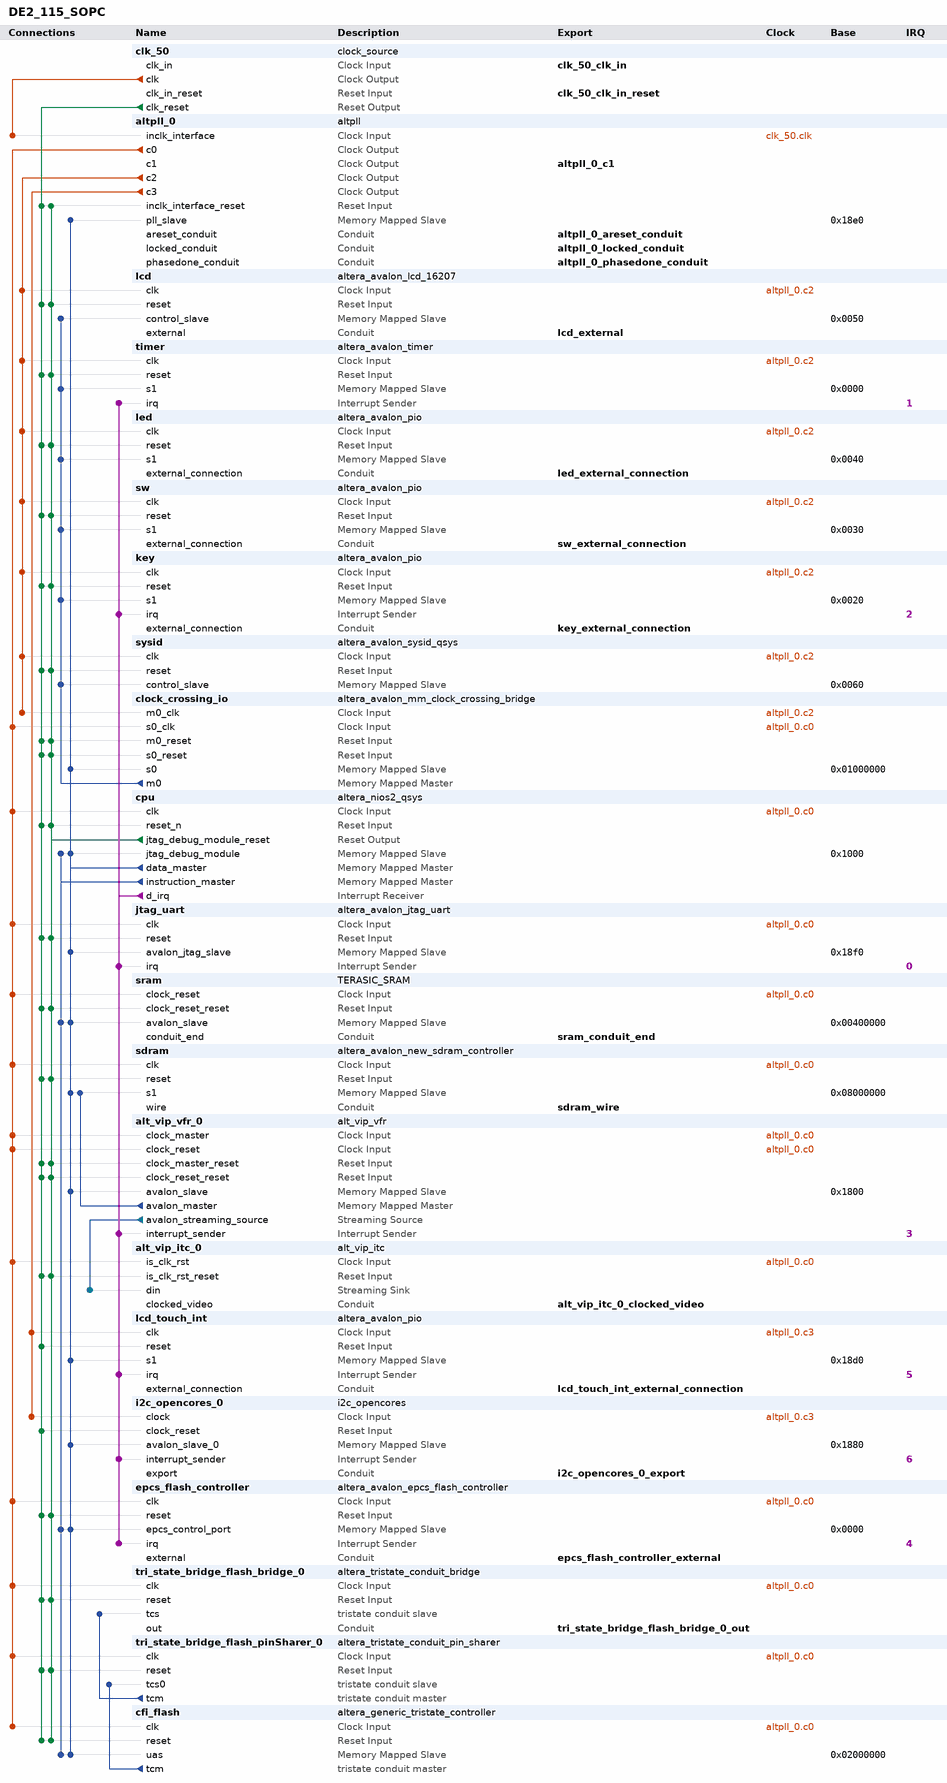
[diagram p0: system contents]
# Platform Designer (Qsys) system DE2_115_SOPC, Cyclone IV E EP4CE115F29C7
# Parameters at their usual value, and those the tool derives, are not listed.
package require -exact qsys 13.1
create_system DE2_115_SOPC
set_project_property DEVICE_FAMILY {Cyclone IV E}
set_project_property DEVICE EP4CE115F29C7

add_instance clk_50 clock_source 13.1
set_instance_parameter_value clk_50 clockFrequency 50000000

add_instance altpll_0 altpll 13.1
set_instance_parameter_value altpll_0 INCLK0_INPUT_FREQUENCY 20000
set_instance_parameter_value altpll_0 CLK0_MULTIPLY_BY 2
set_instance_parameter_value altpll_0 CLK1_MULTIPLY_BY 2
set_instance_parameter_value altpll_0 CLK2_MULTIPLY_BY 2
set_instance_parameter_value altpll_0 CLK3_MULTIPLY_BY 1
set_instance_parameter_value altpll_0 CLK0_DIVIDE_BY 1
set_instance_parameter_value altpll_0 CLK1_DIVIDE_BY 1
set_instance_parameter_value altpll_0 CLK2_DIVIDE_BY 5
set_instance_parameter_value altpll_0 CLK3_DIVIDE_BY 1
set_instance_parameter_value altpll_0 CLK1_PHASE_SHIFT -1667
set_instance_parameter_value altpll_0 CLK2_PHASE_SHIFT 0
set_instance_parameter_value altpll_0 CLK3_PHASE_SHIFT 0
set_instance_parameter_value altpll_0 CLK1_DUTY_CYCLE 50
set_instance_parameter_value altpll_0 CLK2_DUTY_CYCLE 50
set_instance_parameter_value altpll_0 CLK3_DUTY_CYCLE 50
set_instance_parameter_value altpll_0 PORT_clk1 PORT_USED
set_instance_parameter_value altpll_0 PORT_clk2 PORT_USED
set_instance_parameter_value altpll_0 PORT_clk3 PORT_USED
set_instance_parameter_value altpll_0 PORT_ARESET PORT_USED
set_instance_parameter_value altpll_0 PORT_LOCKED PORT_USED

add_instance lcd altera_avalon_lcd_16207 13.1

add_instance timer altera_avalon_timer 13.1
set_instance_parameter_value timer period 1
set_instance_parameter_value timer periodUnits MSEC

add_instance led altera_avalon_pio 13.1
set_instance_parameter_value led direction Output
set_instance_parameter_value led width 27

add_instance sw altera_avalon_pio 13.1
set_instance_parameter_value sw direction Input
set_instance_parameter_value sw width 18

add_instance key altera_avalon_pio 13.1
set_instance_parameter_value key captureEdge true
set_instance_parameter_value key direction Input
set_instance_parameter_value key edgeType FALLING
set_instance_parameter_value key generateIRQ true
set_instance_parameter_value key irqType EDGE
set_instance_parameter_value key width 4

add_instance sysid altera_avalon_sysid_qsys 13.1
set_instance_parameter_value sysid id 0

add_instance clock_crossing_io altera_avalon_mm_clock_crossing_bridge 13.1
set_instance_parameter_value clock_crossing_io DATA_WIDTH 32
set_instance_parameter_value clock_crossing_io ADDRESS_WIDTH 8
set_instance_parameter_value clock_crossing_io MAX_BURST_SIZE 1
set_instance_parameter_value clock_crossing_io COMMAND_FIFO_DEPTH 16
set_instance_parameter_value clock_crossing_io RESPONSE_FIFO_DEPTH 64
set_instance_parameter_value clock_crossing_io MASTER_SYNC_DEPTH 3
set_instance_parameter_value clock_crossing_io SLAVE_SYNC_DEPTH 3

add_instance cpu altera_nios2_qsys 13.1
set_instance_parameter_value cpu manuallyAssignCpuID false
set_instance_parameter_value cpu resetSlave cfi_flash.uas
set_instance_parameter_value cpu exceptionSlave sram.avalon_slave
set_instance_parameter_value cpu breakSlave cpu.jtag_debug_module
set_instance_parameter_value cpu muldiv_multiplierType NoneSmall
set_instance_parameter_value cpu impl Fast
set_instance_parameter_value cpu icache_size 4096

add_instance jtag_uart altera_avalon_jtag_uart 13.1
set_instance_parameter_value jtag_uart simInteractiveOptions INTERACTIVE_ASCII_OUTPUT

add_instance sram TERASIC_SRAM 1.0
set_instance_parameter_value sram DATA_BITS 16
set_instance_parameter_value sram ADDR_BITS 20

add_instance sdram altera_avalon_new_sdram_controller 13.1
set_instance_parameter_value sdram TAC 5.4
set_instance_parameter_value sdram TRCD 20.0
set_instance_parameter_value sdram TRP 20.0
set_instance_parameter_value sdram casLatency 3
set_instance_parameter_value sdram columnWidth 10
set_instance_parameter_value sdram dataWidth 32
set_instance_parameter_value sdram generateSimulationModel false
set_instance_parameter_value sdram model custom
set_instance_parameter_value sdram numberOfBanks 4
set_instance_parameter_value sdram numberOfChipSelects 1
set_instance_parameter_value sdram powerUpDelay 100.0
set_instance_parameter_value sdram refreshPeriod 15.625
set_instance_parameter_value sdram rowWidth 13

add_instance alt_vip_vfr_0 alt_vip_vfr 13.1
set_instance_parameter_value alt_vip_vfr_0 NUMBER_OF_CHANNELS_IN_PARALLEL 3
set_instance_parameter_value alt_vip_vfr_0 MAX_IMAGE_WIDTH 800
set_instance_parameter_value alt_vip_vfr_0 MAX_IMAGE_HEIGHT 480
set_instance_parameter_value alt_vip_vfr_0 MEM_PORT_WIDTH 32
set_instance_parameter_value alt_vip_vfr_0 CLOCKS_ARE_SEPARATE 0

add_instance alt_vip_itc_0 alt_vip_itc 13.1
set_instance_parameter_value alt_vip_itc_0 NUMBER_OF_COLOUR_PLANES 3
set_instance_parameter_value alt_vip_itc_0 H_ACTIVE_PIXELS 800
set_instance_parameter_value alt_vip_itc_0 V_ACTIVE_LINES 480
set_instance_parameter_value alt_vip_itc_0 FIFO_DEPTH 800
set_instance_parameter_value alt_vip_itc_0 THRESHOLD 799
set_instance_parameter_value alt_vip_itc_0 H_SYNC_LENGTH 30
set_instance_parameter_value alt_vip_itc_0 H_FRONT_PORCH 210
set_instance_parameter_value alt_vip_itc_0 H_BACK_PORCH 16
set_instance_parameter_value alt_vip_itc_0 V_SYNC_LENGTH 13
set_instance_parameter_value alt_vip_itc_0 V_FRONT_PORCH 22
set_instance_parameter_value alt_vip_itc_0 V_BACK_PORCH 10

add_instance lcd_touch_int altera_avalon_pio 13.1
set_instance_parameter_value lcd_touch_int captureEdge true
set_instance_parameter_value lcd_touch_int direction Input
set_instance_parameter_value lcd_touch_int edgeType FALLING
set_instance_parameter_value lcd_touch_int generateIRQ true
set_instance_parameter_value lcd_touch_int irqType EDGE
set_instance_parameter_value lcd_touch_int width 1

add_instance i2c_opencores_0 i2c_opencores 12.0

add_instance epcs_flash_controller altera_avalon_epcs_flash_controller 13.1

add_instance tri_state_bridge_flash_bridge_0 altera_tristate_conduit_bridge 13.1

add_instance tri_state_bridge_flash_pinSharer_0 altera_tristate_conduit_pin_sharer 13.1
set_instance_parameter_value tri_state_bridge_flash_pinSharer_0 NUM_INTERFACES 1
set_instance_parameter_value tri_state_bridge_flash_pinSharer_0 MODULE_ORIGIN_LIST cfi_flash.tcm,cfi_flash.tcm,cfi_flash.tcm,cfi_flash.tcm,cfi_flash.tcm
set_instance_parameter_value tri_state_bridge_flash_pinSharer_0 SHARED_SIGNAL_LIST address_to_the_cfi_flash,read_n_to_the_cfi_flash,write_n_to_the_cfi_flash,data_to_and_from_the_cfi_flash,select_n_to_the_cfi_flash

add_instance cfi_flash altera_generic_tristate_controller 13.1
set_instance_parameter_value cfi_flash TCM_ADDRESS_W 23
set_instance_parameter_value cfi_flash TCM_DATA_W 8
set_instance_parameter_value cfi_flash TCM_BYTEENABLE_W 1
set_instance_parameter_value cfi_flash TCM_READ_WAIT 160
set_instance_parameter_value cfi_flash TCM_WRITE_WAIT 160
set_instance_parameter_value cfi_flash TCM_SETUP_WAIT 60
set_instance_parameter_value cfi_flash TCM_DATA_HOLD 60
set_instance_parameter_value cfi_flash TCM_MAX_PENDING_READ_TRANSACTIONS 3
set_instance_parameter_value cfi_flash TCM_TURNAROUND_TIME 2
set_instance_parameter_value cfi_flash TCM_TIMING_UNITS 0
set_instance_parameter_value cfi_flash TCM_READLATENCY 2
set_instance_parameter_value cfi_flash TCM_SYMBOLS_PER_WORD 1
set_instance_parameter_value cfi_flash USE_READ 1
set_instance_parameter_value cfi_flash USE_BEGINTRANSFER 0
set_instance_parameter_value cfi_flash USE_BYTEENABLE 0
set_instance_parameter_value cfi_flash USE_OUTPUTENABLE 0
set_instance_parameter_value cfi_flash ACTIVE_LOW_READ 1
set_instance_parameter_value cfi_flash ACTIVE_LOW_BYTEENABLE 0
set_instance_parameter_value cfi_flash ACTIVE_LOW_OUTPUTENABLE 0
set_instance_parameter_value cfi_flash ACTIVE_LOW_BEGINTRANSFER 0
set_instance_parameter_value cfi_flash CHIPSELECT_THROUGH_READLATENCY 0
set_instance_parameter_value cfi_flash MODULE_ASSIGNMENT_KEYS embeddedsw.configuration.hwClassnameDriverSupportList,embeddedsw.configuration.hwClassnameDriverSupportDefault,embeddedsw.CMacro.SETUP_VALUE,embeddedsw.CMacro.WAIT_VALUE,embeddedsw.CMacro.HOLD_VALUE,embeddedsw.CMacro.TIMING_UNITS,embeddedsw.CMacro.SIZE,embeddedsw.memoryInfo.MEM_INIT_DATA_WIDTH,embeddedsw.memoryInfo.HAS_BYTE_LANE,embeddedsw.memoryInfo.IS_FLASH,embeddedsw.memoryInfo.GENERATE_DAT_SYM,embeddedsw.memoryInfo.GENERATE_FLASH,embeddedsw.memoryInfo.DAT_SYM_INSTALL_DIR,embeddedsw.memoryInfo.FLASH_INSTALL_DIR
set_instance_parameter_value cfi_flash MODULE_ASSIGNMENT_VALUES {altera_avalon_lan91c111:altera_avalon_cfi_flash,altera_avalon_cfi_flash,60,160,60,"ns",8388608u,8,0,1,1,1,SIM_DIR,APP_DIR}
set_instance_parameter_value cfi_flash INTERFACE_ASSIGNMENT_KEYS embeddedsw.configuration.isFlash,embeddedsw.configuration.isMemoryDevice,embeddedsw.configuration.isNonVolatileStorage
set_instance_parameter_value cfi_flash INTERFACE_ASSIGNMENT_VALUES 1,1,1

# connections
add_connection altpll_0.c0 alt_vip_itc_0.is_clk_rst clock
add_connection altpll_0.c0 alt_vip_vfr_0.clock_master clock
add_connection altpll_0.c0 alt_vip_vfr_0.clock_reset clock
add_connection altpll_0.c0 cfi_flash.clk clock
add_connection altpll_0.c0 clock_crossing_io.s0_clk clock
add_connection altpll_0.c0 cpu.clk clock
add_connection altpll_0.c0 epcs_flash_controller.clk clock
add_connection altpll_0.c0 jtag_uart.clk clock
add_connection altpll_0.c0 sdram.clk clock
add_connection altpll_0.c0 sram.clock_reset clock
add_connection altpll_0.c0 tri_state_bridge_flash_bridge_0.clk clock
add_connection altpll_0.c0 tri_state_bridge_flash_pinSharer_0.clk clock
add_connection altpll_0.c2 clock_crossing_io.m0_clk clock
add_connection altpll_0.c2 key.clk clock
add_connection altpll_0.c2 lcd.clk clock
add_connection altpll_0.c2 led.clk clock
add_connection altpll_0.c2 sw.clk clock
add_connection altpll_0.c2 sysid.clk clock
add_connection altpll_0.c2 timer.clk clock
add_connection altpll_0.c3 i2c_opencores_0.clock clock
add_connection altpll_0.c3 lcd_touch_int.clk clock
add_connection clk_50.clk altpll_0.inclk_interface clock
add_connection clk_50.clk_reset alt_vip_itc_0.is_clk_rst_reset reset
add_connection clk_50.clk_reset alt_vip_vfr_0.clock_master_reset reset
add_connection clk_50.clk_reset alt_vip_vfr_0.clock_reset_reset reset
add_connection clk_50.clk_reset altpll_0.inclk_interface_reset reset
add_connection clk_50.clk_reset cfi_flash.reset reset
add_connection clk_50.clk_reset clock_crossing_io.m0_reset reset
add_connection clk_50.clk_reset clock_crossing_io.s0_reset reset
add_connection clk_50.clk_reset cpu.reset_n reset
add_connection clk_50.clk_reset epcs_flash_controller.reset reset
add_connection clk_50.clk_reset i2c_opencores_0.clock_reset reset
add_connection clk_50.clk_reset jtag_uart.reset reset
add_connection clk_50.clk_reset key.reset reset
add_connection clk_50.clk_reset lcd.reset reset
add_connection clk_50.clk_reset lcd_touch_int.reset reset
add_connection clk_50.clk_reset led.reset reset
add_connection clk_50.clk_reset sdram.reset reset
add_connection clk_50.clk_reset sram.clock_reset_reset reset
add_connection clk_50.clk_reset sw.reset reset
add_connection clk_50.clk_reset sysid.reset reset
add_connection clk_50.clk_reset timer.reset reset
add_connection clk_50.clk_reset tri_state_bridge_flash_bridge_0.reset reset
add_connection clk_50.clk_reset tri_state_bridge_flash_pinSharer_0.reset reset
add_connection cpu.jtag_debug_module_reset alt_vip_itc_0.is_clk_rst_reset reset
add_connection cpu.jtag_debug_module_reset alt_vip_vfr_0.clock_master_reset reset
add_connection cpu.jtag_debug_module_reset alt_vip_vfr_0.clock_reset_reset reset
add_connection cpu.jtag_debug_module_reset altpll_0.inclk_interface_reset reset
add_connection cpu.jtag_debug_module_reset cfi_flash.reset reset
add_connection cpu.jtag_debug_module_reset clock_crossing_io.m0_reset reset
add_connection cpu.jtag_debug_module_reset clock_crossing_io.s0_reset reset
add_connection cpu.jtag_debug_module_reset cpu.reset_n reset
add_connection cpu.jtag_debug_module_reset epcs_flash_controller.reset reset
add_connection cpu.jtag_debug_module_reset jtag_uart.reset reset
add_connection cpu.jtag_debug_module_reset key.reset reset
add_connection cpu.jtag_debug_module_reset lcd.reset reset
add_connection cpu.jtag_debug_module_reset led.reset reset
add_connection cpu.jtag_debug_module_reset sdram.reset reset
add_connection cpu.jtag_debug_module_reset sram.clock_reset_reset reset
add_connection cpu.jtag_debug_module_reset sw.reset reset
add_connection cpu.jtag_debug_module_reset sysid.reset reset
add_connection cpu.jtag_debug_module_reset timer.reset reset
add_connection cpu.jtag_debug_module_reset tri_state_bridge_flash_bridge_0.reset reset
add_connection cpu.jtag_debug_module_reset tri_state_bridge_flash_pinSharer_0.reset reset
add_connection alt_vip_vfr_0.avalon_master sdram.s1 avalon
set_connection_parameter_value alt_vip_vfr_0.avalon_master/sdram.s1 baseAddress 0x08000000
add_connection clock_crossing_io.m0 key.s1 avalon
set_connection_parameter_value clock_crossing_io.m0/key.s1 baseAddress 0x0020
add_connection clock_crossing_io.m0 lcd.control_slave avalon
set_connection_parameter_value clock_crossing_io.m0/lcd.control_slave baseAddress 0x0050
add_connection clock_crossing_io.m0 led.s1 avalon
set_connection_parameter_value clock_crossing_io.m0/led.s1 baseAddress 0x0040
add_connection clock_crossing_io.m0 sw.s1 avalon
set_connection_parameter_value clock_crossing_io.m0/sw.s1 baseAddress 0x0030
add_connection clock_crossing_io.m0 sysid.control_slave avalon
set_connection_parameter_value clock_crossing_io.m0/sysid.control_slave baseAddress 0x0060
add_connection clock_crossing_io.m0 timer.s1 avalon
set_connection_parameter_value clock_crossing_io.m0/timer.s1 baseAddress 0x0000
add_connection cpu.data_master alt_vip_vfr_0.avalon_slave avalon
set_connection_parameter_value cpu.data_master/alt_vip_vfr_0.avalon_slave baseAddress 0x1800
add_connection cpu.data_master altpll_0.pll_slave avalon
set_connection_parameter_value cpu.data_master/altpll_0.pll_slave baseAddress 0x18e0
add_connection cpu.data_master cfi_flash.uas avalon
set_connection_parameter_value cpu.data_master/cfi_flash.uas baseAddress 0x02000000
add_connection cpu.data_master clock_crossing_io.s0 avalon
set_connection_parameter_value cpu.data_master/clock_crossing_io.s0 baseAddress 0x01000000
add_connection cpu.data_master cpu.jtag_debug_module avalon
set_connection_parameter_value cpu.data_master/cpu.jtag_debug_module baseAddress 0x1000
add_connection cpu.data_master epcs_flash_controller.epcs_control_port avalon
set_connection_parameter_value cpu.data_master/epcs_flash_controller.epcs_control_port baseAddress 0x0000
add_connection cpu.data_master i2c_opencores_0.avalon_slave_0 avalon
set_connection_parameter_value cpu.data_master/i2c_opencores_0.avalon_slave_0 baseAddress 0x1880
add_connection cpu.data_master jtag_uart.avalon_jtag_slave avalon
set_connection_parameter_value cpu.data_master/jtag_uart.avalon_jtag_slave baseAddress 0x18f0
add_connection cpu.data_master lcd_touch_int.s1 avalon
set_connection_parameter_value cpu.data_master/lcd_touch_int.s1 baseAddress 0x18d0
add_connection cpu.data_master sdram.s1 avalon
set_connection_parameter_value cpu.data_master/sdram.s1 baseAddress 0x08000000
add_connection cpu.data_master sram.avalon_slave avalon
set_connection_parameter_value cpu.data_master/sram.avalon_slave baseAddress 0x00400000
add_connection cpu.instruction_master cfi_flash.uas avalon
set_connection_parameter_value cpu.instruction_master/cfi_flash.uas baseAddress 0x02000000
add_connection cpu.instruction_master cpu.jtag_debug_module avalon
set_connection_parameter_value cpu.instruction_master/cpu.jtag_debug_module baseAddress 0x1000
add_connection cpu.instruction_master epcs_flash_controller.epcs_control_port avalon
set_connection_parameter_value cpu.instruction_master/epcs_flash_controller.epcs_control_port baseAddress 0x0000
add_connection cpu.instruction_master sram.avalon_slave avalon
set_connection_parameter_value cpu.instruction_master/sram.avalon_slave baseAddress 0x00400000
add_connection alt_vip_vfr_0.avalon_streaming_source alt_vip_itc_0.din avalon_streaming
add_connection cpu.d_irq alt_vip_vfr_0.interrupt_sender interrupt
set_connection_parameter_value cpu.d_irq/alt_vip_vfr_0.interrupt_sender irqNumber 3
add_connection cpu.d_irq epcs_flash_controller.irq interrupt
set_connection_parameter_value cpu.d_irq/epcs_flash_controller.irq irqNumber 4
add_connection cpu.d_irq i2c_opencores_0.interrupt_sender interrupt
set_connection_parameter_value cpu.d_irq/i2c_opencores_0.interrupt_sender irqNumber 6
add_connection cpu.d_irq jtag_uart.irq interrupt
set_connection_parameter_value cpu.d_irq/jtag_uart.irq irqNumber 0
add_connection cpu.d_irq key.irq interrupt
set_connection_parameter_value cpu.d_irq/key.irq irqNumber 2
add_connection cpu.d_irq lcd_touch_int.irq interrupt
set_connection_parameter_value cpu.d_irq/lcd_touch_int.irq irqNumber 5
add_connection cpu.d_irq timer.irq interrupt
set_connection_parameter_value cpu.d_irq/timer.irq irqNumber 1
add_connection cfi_flash.tcm tri_state_bridge_flash_pinSharer_0.tcs0 tristate_conduit
add_connection tri_state_bridge_flash_pinSharer_0.tcm tri_state_bridge_flash_bridge_0.tcs tristate_conduit

# exported interfaces
add_interface tri_state_bridge_flash_bridge_0_out conduit end
set_interface_property tri_state_bridge_flash_bridge_0_out EXPORT_OF tri_state_bridge_flash_bridge_0.out
add_interface clk_50_clk_in_reset reset sink
set_interface_property clk_50_clk_in_reset EXPORT_OF clk_50.clk_in_reset
add_interface clk_50_clk_in clock sink
set_interface_property clk_50_clk_in EXPORT_OF clk_50.clk_in
add_interface lcd_external conduit end
set_interface_property lcd_external EXPORT_OF lcd.external
add_interface altpll_0_c1 clock source
set_interface_property altpll_0_c1 EXPORT_OF altpll_0.c1
add_interface altpll_0_locked_conduit conduit end
set_interface_property altpll_0_locked_conduit EXPORT_OF altpll_0.locked_conduit
add_interface altpll_0_phasedone_conduit conduit end
set_interface_property altpll_0_phasedone_conduit EXPORT_OF altpll_0.phasedone_conduit
add_interface sdram_wire conduit end
set_interface_property sdram_wire EXPORT_OF sdram.wire
add_interface alt_vip_itc_0_clocked_video conduit end
set_interface_property alt_vip_itc_0_clocked_video EXPORT_OF alt_vip_itc_0.clocked_video
add_interface sram_conduit_end conduit end
set_interface_property sram_conduit_end EXPORT_OF sram.conduit_end
add_interface led_external_connection conduit end
set_interface_property led_external_connection EXPORT_OF led.external_connection
add_interface sw_external_connection conduit end
set_interface_property sw_external_connection EXPORT_OF sw.external_connection
add_interface key_external_connection conduit end
set_interface_property key_external_connection EXPORT_OF key.external_connection
add_interface epcs_flash_controller_external conduit end
set_interface_property epcs_flash_controller_external EXPORT_OF epcs_flash_controller.external
add_interface altpll_0_areset_conduit conduit end
set_interface_property altpll_0_areset_conduit EXPORT_OF altpll_0.areset_conduit
add_interface lcd_touch_int_external_connection conduit end
set_interface_property lcd_touch_int_external_connection EXPORT_OF lcd_touch_int.external_connection
add_interface i2c_opencores_0_export conduit end
set_interface_property i2c_opencores_0_export EXPORT_OF i2c_opencores_0.export

set_interconnect_requirement {$system} qsys_mm.clockCrossingAdapter HANDSHAKE
set_interconnect_requirement {$system} qsys_mm.maxAdditionalLatency 0

save_system DE2_115_SOPC.qsys
